# Altium schematic sheet Audio_Output_Headphone.SchDoc: Audio Output: Headphone Out
size 279 x 215 mm; DrawnBy: Connor Dack; Engineer: Connor Dack; DocumentNumber: 17; Revision: 1.0; SheetNumber: 17; SheetTotal: 20
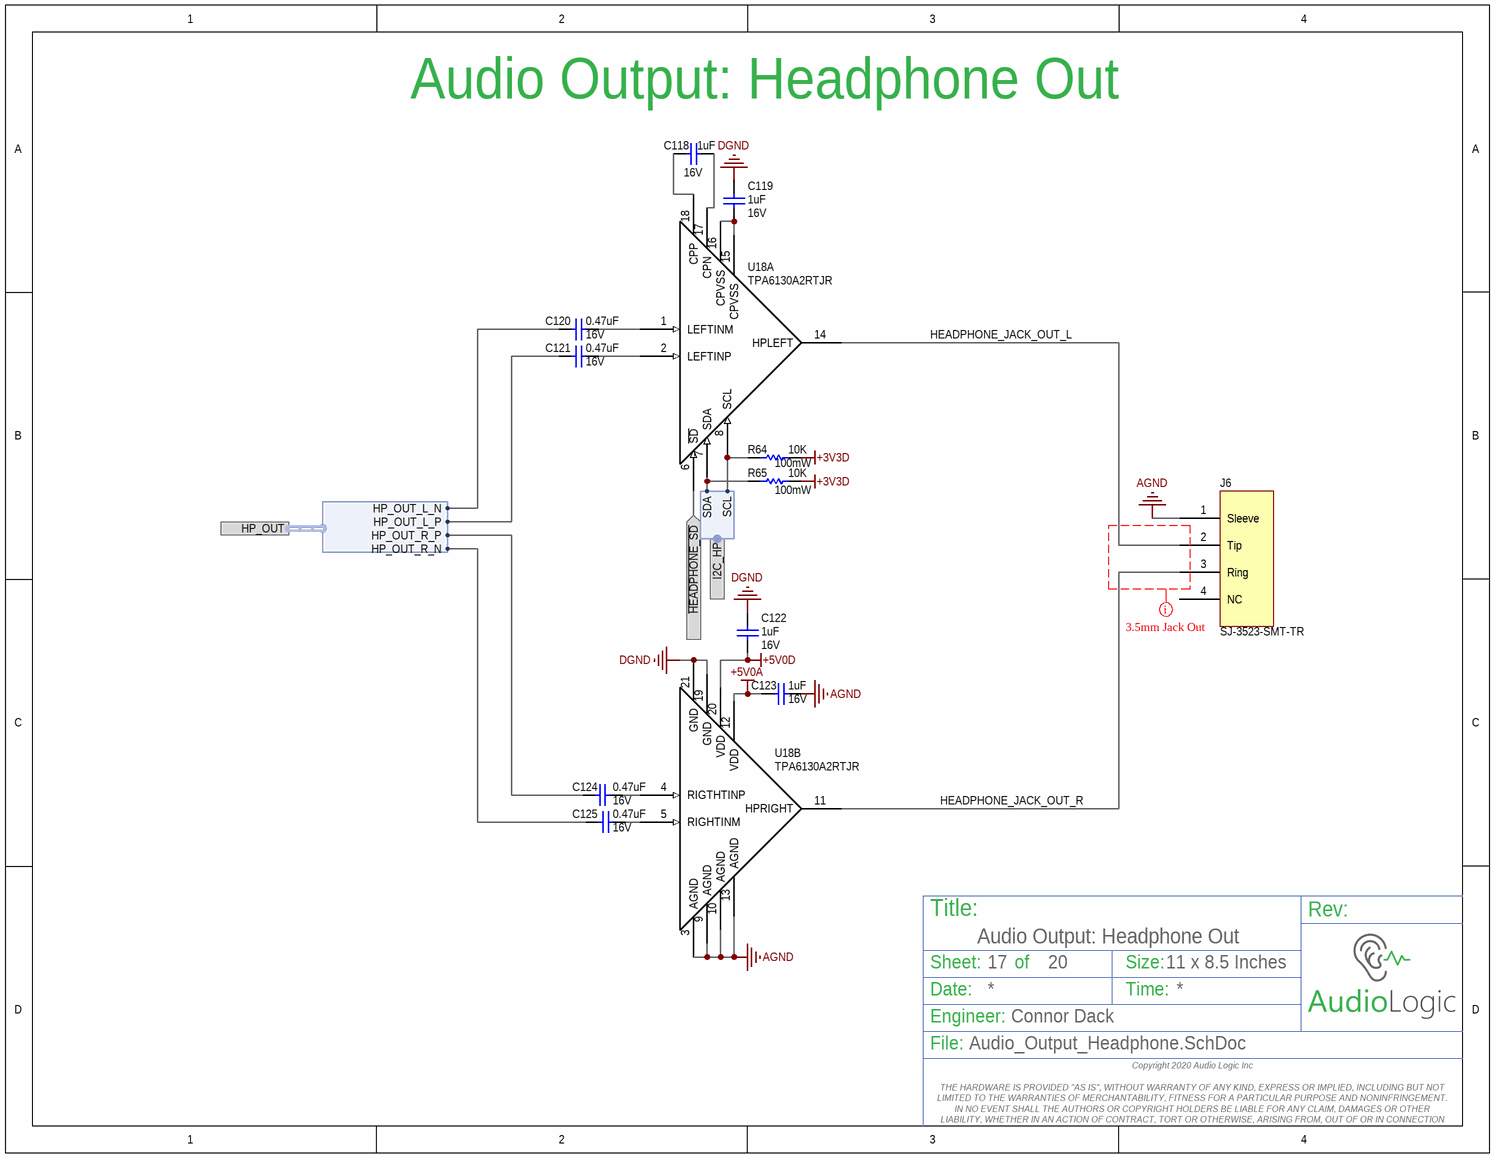
[diagram p0: Audio_Output_Headphone.SchDoc]

## Parts
C118  Voltage Rating: 16V  Capacitance: 1uF  [3-0603_L]  (hidden comment: CGA3E1X7R1C105M080AC)
C119  Voltage Rating (DC): 16V  Capacitance: 1uF  [3-0603_L]  (hidden comment: CGA3E1X7R1C105M080AC)
C120  Voltage Rating: 16V  Capacitance: 0.47uF  [3-0603_L]  (hidden comment: CGA3E1X7R1C474M080AC)
C121  Voltage Rating: 16V  Capacitance: 0.47uF  [3-0603_L]  (hidden comment: CGA3E1X7R1C474M080AC)
C122  Voltage Rating: 16V  Capacitance: 1uF  [3-0603_L]  (hidden comment: CGA3E1X7R1C105M080AC)
C123  Voltage Rating: 16V  Capacitance: 1uF  [3-0603_L]  (hidden comment: CGA3E1X7R1C105M080AC)
C124  Voltage Rating: 16V  Capacitance: 0.47uF  [3-0603_L]  (hidden comment: CGA3E1X7R1C474M080AC)
C125  Voltage Rating: 16V  Capacitance: 0.47uF  [3-0603_L]  (hidden comment: CGA3E1X7R1C474M080AC)
J6  SJ-3523-SMT-TR  [SJ-3523-SMT-TR]
R64  Power (Watts): 100mW  Resistance (Ohms): 10K  [3-0603_R_L_DNP]  (hidden comment: ERJ-3GEYJ103V)
R65  Power (Watts): 100mW  Resistance (Ohms): 10K  [3-0603_R_L_DNP]  (hidden comment: ERJ-3GEYJ103V)
U18  TPA6130A2RTJR  [QFN50P400X400X80_HS-21N]  (parts A,B of 2)

## Ports
HP_OUT (harness HP_OUT), I2C_HP (harness I2C_Headphone), ~{HEADPHONE_SD} (in)

## Harnesses
I2C_Headphone: SDA, SCL
HP_OUT: HP_OUT_L_N, HP_OUT_L_P, HP_OUT_R_N, HP_OUT_R_P

## Nets
+3V3D: R64.2 R65.2
+5V0A: C123.2 U18.12(VDD)
+5V0D: C122.1 U18.20(VDD)
AGND: C123.1 J6.1(Sleeve) U18.3(AGND) U18.9(AGND) U18.10(AGND) U18.13(AGND)
DGND: C119.2 C122.2 U18.19(GND) U18.21(GND)
~{HEADPHONE_SD}: U18.6(~{SD}) ; port ~{HEADPHONE_SD}
HEADPHONE_JACK_OUT_L: J6.2(Tip) U18.14(HPLEFT)
HEADPHONE_JACK_OUT_R: J6.3(Ring) U18.11(HPRIGHT)
NetC118_1: C118.1 U18.18(CPP)
NetC118_2: C118.2 U18.17(CPN)
NetC119_1: C119.1 U18.15(CPVSS) U18.16(CPVSS)
NetC120_1: C120.1 ; port HP_OUT.HP_OUT_L_N
NetC120_2: C120.2 U18.1(LEFTINM)
NetC121_1: C121.1 ; port HP_OUT.HP_OUT_L_P
NetC121_2: C121.2 U18.2(LEFTINP)
NetC124_1: C124.1 ; port HP_OUT.HP_OUT_R_P
NetC124_2: C124.2 U18.4(RIGTHTINP)
NetC125_1: C125.1 ; port HP_OUT.HP_OUT_R_N
NetC125_2: C125.2 U18.5(RIGHTINM)
NetR64_1: R64.1 U18.8(SCL) ; port I2C_HP.SCL
NetR65_1: R65.1 U18.7(SDA) ; port I2C_HP.SDA

Not connected (* = marked no-connect by the designer): J6 4(NC)

## Layout directives
net class 3.5mm Jack Out: (no net found under the mark)

## Notes on the sheet
- (near C118) Audio Output: Headphone Out
- Title:
- Sheet:
- of
- Size:
- 11 x 8.5 Inches
- Rev:
- Date:
- Engineer:
- Time:
- File:
- Copyright 2020 Audio Logic Inc
  THE HARDWARE IS PROVIDED "AS IS", WITHOUT WARRANTY OF ANY KIND, EXPRESS OR IMPLIED, INCLUDING BUT NOT LIMITED TO THE WARRANTIES OF MERCHANTABILITY, FITNESS FOR A PARTICULAR PURPOSE AND NONINFRINGEMENT. IN NO EVENT SHALL THE AUTHORS OR COPYRIGHT HOLDERS BE LIABLE FOR ANY CLAIM, DAMAGES OR OTHER LIABILITY, WHETHER IN AN ACTION OF CONTRACT, TORT OR OTHERWISE, ARISING FROM, OUT OF OR IN CONNECTION WITH THE HARDWARE OR THE USE OR OTHER DEALINGS IN THE HARDWARE.

## Library data of the parts
C118 C119 C122 C123 = CGA3E1X7R1C105M080AC: CAP CER 1UF 16V X7R 0603; Manufacturer: TDK; Tolerance: 20%; Supplier 1: Digi-Key; Manufacturer Part Number: CGA3E1X7R1C105M080AC; Stock 1: 18034; Pricing 1: 1=0.14, 10=0.1, 100=0.0468, 500=0.0328, 1000=0.0272 (USD); Mount: Surface Mount; Case/Package: 0603; Weight: 7.1E-05oz; Case Code (Metric): 1608; Case Code (Imperial): 0603; Min Operating Temperature: -55°C; Max Operating Temperature: 125°C; Package Quantity: 4000; Packaging: Tape and Reel; Dielectric: X7R; Termination: SMD/SMT; Length: 0.063inch; Height: 0.8mm; Width: 0.031inch; Thickness: 0.035inch; Lead Free: Lead Free; ComponentLink1URL: https://product.tdk.com/info/en/catalog/datasheets/mlcc_automotive_general_en.pdf; ComponentLink1Description: https://product.tdk.com/info/en/catalog/datasheets/mlcc_automotive_general_en.pdf; ComponentLink2URL: http://product.tdk.com/capacitor/mlcc/detailed_information.php?lang=en&ref=jp&part_no=CGA3E1X7R1C105M080AC; ComponentLink2Description: http://product.tdk.com/capacitor/mlcc/detailed_information.php?lang=en&ref=jp&part_no=CGA3E1X7R1C105M080AC; ComponentLink3URL: http://product.tdk.com/en/catalog/datasheets/mlcc_automotive_general_en.pdf; ComponentLink3Description: http://product.tdk.com/en/catalog/datasheets/mlcc_automotive_general_en.pdf; Supplier Part Number 1: 445-12540-6-ND
  C118 C122 C123: Voltage Rating (DC): 16V
  C119: Voltage Rating: 16V
C120 C121 C124 C125 = CGA3E1X7R1C474M080AC: CAP CER 0.47UF 16V X7R 0603; Manufacturer: TDK; Tolerance: 20%; Supplier 1: Digi-Key; Manufacturer Part Number: CGA3E1X7R1C474M080AC; Stock 1: 6138; Pricing 1: 1=0.18, 10=0.129, 100=0.0605, 500=0.0424, 1000=0.0351 (USD); Mount: Surface Mount; Case/Package: 0603; Weight: 7.1E-05oz; Case Code (Metric): 1608; Case Code (Imperial): 0603; Min Operating Temperature: -55°C; Max Operating Temperature: 125°C; Package Quantity: 4000; Packaging: Tape and Reel; Dielectric: X7R; Voltage Rating (DC): 16V; Length: 0.063inch; Height: 0.8mm; Width: 0.031inch; Thickness: 0.035inch; ComponentLink1URL: https://product.tdk.com/info/en/catalog/datasheets/mlcc_automotive_general_en.pdf; ComponentLink1Description: https://product.tdk.com/info/en/catalog/datasheets/mlcc_automotive_general_en.pdf; ComponentLink2URL: http://product.tdk.com/capacitor/mlcc/detailed_information.php?lang=en&ref=jp&part_no=CGA3E1X7R1C474M080AC; ComponentLink2Description: http://product.tdk.com/capacitor/mlcc/detailed_information.php?lang=en&ref=jp&part_no=CGA3E1X7R1C474M080AC; ComponentLink3URL: http://product.tdk.com/en/catalog/datasheets/mlcc_automotive_general_en.pdf; ComponentLink3Description: http://product.tdk.com/en/catalog/datasheets/mlcc_automotive_general_en.pdf; Supplier Part Number 1: 445-12537-6-ND
J6 = SJ-3523-SMT-TR: 3.50mm (0.141", 1/8", Mini Plug) - Headphone Phone Jack Stereo Connector Solder; Manufacturer: CUI Inc.; Gender: Female; Actual Diameter: 0.142" (3.60mm); Number of Positions/Contacts: 3 Conductors, 3 Contacts; Internal Switch(s): Does Not Contain Switch; Shielding: Unshielded; Voltage - Rated: 12VDC; Current Rating: 1A; Mating Length/Depth: 0.551" (14.00mm); Body Color: Black; Includes: 1 pc - 1 Connector; Notes: FE Provides: 23; LatestRevisionDate: 17-Jul-2002; LatestRevisionNote: Re-released for DXP Platform.; Publisher: Altium Limited; Supplier 1: Digi-Key; RoHS: RoHS Compliant; Category: Connectors, Interconnects; Stock 1: 104981; Pricing 1: 1=1.34, 10=1.043, 100=0.7961, 500=0.63558 (USD); Packaging: Cut Tape (CT); Part Status: Active; Connector Type: Phone Jack; Signal Lines: Stereo; Industry Recognized Mating Diameter: 3.50mm (0.141", 1/8", Mini Plug) - Headphone; Mounting Type: Surface Mount, Right Angle; Termination: Solder; Features: Board Guide; Insulation Color: -; Contact Material - Plating: Silver; Body Material: -; ComponentLink1URL: http://www.cui.com/product/resource/digikeypdf/sj-352x-smt_series.pdf; ComponentLink1Description: http://www.cui.com/product/resource/digikeypdf/sj-352x-smt_series.pdf; Supplier Part Number 1: CP-3523SJCT-ND; Manufacturer Part Number: SJ-3523-SMT-TR; Load Status: *
R64 R65 = ERJ-3GEYJ103V: RES 10K OHM 1/10W 5% 0603 SMD; Manufacturer: Panasonic - ECG; Temperature Coefficient: ±200ppm/°C; Supplier 1: Digi-Key; Manufacturer Part Number: ERJ-3GEYJ103V; RoHS: RoHS Compliant; Category: Resistors; Stock 1: 16219504; Pricing 1: 1=0.02, 50=0.0092, 100=0.007, 250=0.0052, 500=0.00384, 1000=0.00256 (USD); Composition: Thick Film; Features: -; Tolerance: ±5%; Package / Case: 0603 (1608 Metric); Size / Dimension: 0.063" L x 0.031" W (1.60mm x 0.80mm); Height: 0.022" (0.55mm); Number of Terminations: 2; Packaging: Cut Tape (CT); ComponentLink1URL: http://industrial.panasonic.com/www-cgi/jvcr13pz.cgi?E+PZ+3+AOA0001+ERJ3GEYJ103V+7+WW; ComponentLink1Description: http://industrial.panasonic.com/www-cgi/jvcr13pz.cgi?E+PZ+3+AOA0001+ERJ3GEYJ103V+7+WW; Supplier Part Number 1: P10KGCT-ND; Load Status: *
U18 = TPA6130A2RTJR: Amplifier IC Headphones, 2-Channel (Stereo) Class AB 20-QFN (4x4); Manufacturer: Texas Instruments; Max Output Power x Channels @ Load: 290mW x 1 @ 16 Ohm; 138mW x 2 @ 16 Ohm; Voltage - Supply: 2.5 V ~ 5.5 V; LatestRevisionDate: 17-Jul-2002; LatestRevisionNote: Re-released for DXP Platform.; Publisher: Altium Limited; Supplier 1: Digi-Key; RoHS: RoHS Compliant; Category: Integrated Circuits (ICs); Stock 1: 15763; Pricing 1: 1=2.19, 10=1.966, 100=1.5768, 500=1.296, 1000=0.9 (USD); Packaging: Cut Tape (CT); Part Status: Active; Type: Class AB; Output Type: Headphones, 2-Channel (Stereo); Features: Depop, Differential Inputs, I²C, Mute, Short-Circuit and Thermal Protection, Shutdown, Volume Control; Mounting Type: Surface Mount; Operating Temperature: -40°C ~ 85°C (TA); Supplier Device Package: 20-QFN (4x4); Package / Case: 20-WFQFN Exposed Pad; ComponentLink1URL: http://www.ti.com/lit/ds/symlink/tpa6130a2.pdf; ComponentLink1Description: http://www.ti.com/lit/ds/symlink/tpa6130a2.pdf; Supplier Part Number 1: 296-21656-1-ND; Manufacturer Part Number: TPA6130A2RTJR